# Altium schematic sheet CAN.SchDoc
size A3
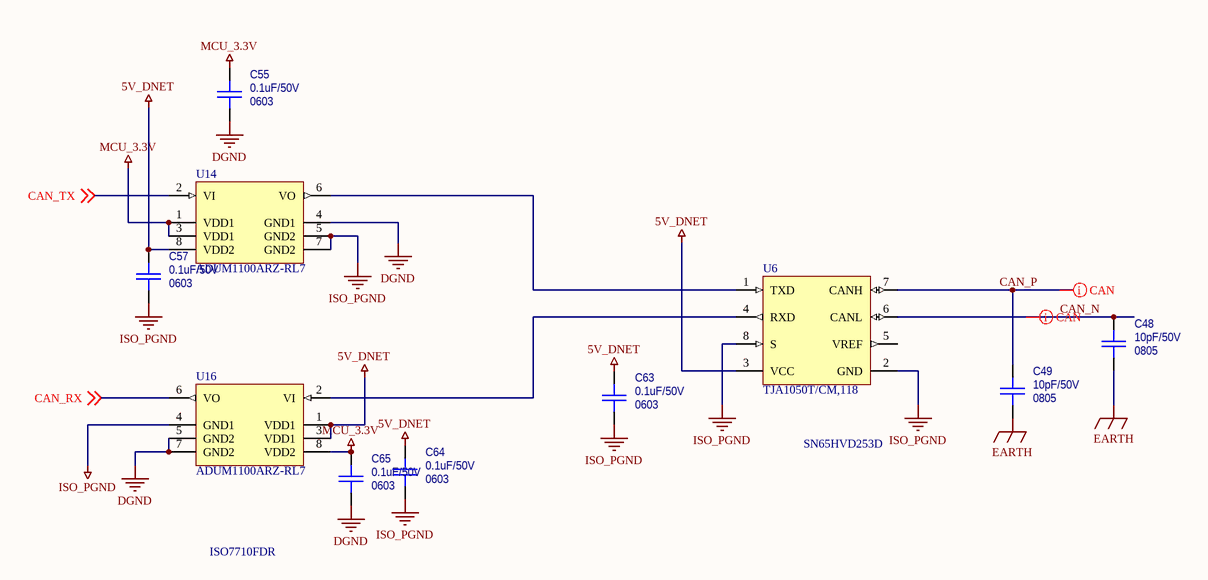
[diagram p0: CAN.SchDoc]

## Parts
C48  Package: 0805  [CAPC2012X127N_0805]  (hidden comment: 10pF/50V)  (no BOM)
C49  Package: 0805  [CAPC2012X127N_0805]  (hidden comment: 10pF/50V)  (no BOM)
C55  Package: 0603  [CAPC1608X092N_0603]  (hidden comment: 0.1uF/50V)  (no BOM)
C57  Package: 0603  [CAPC1608X092N_0603]  (hidden comment: 0.1uF/50V)  (no BOM)
C63  Package: 0603  [CAPC1608X092N_0603]  (hidden comment: 0.1uF/50V)  (no BOM)
C64  Package: 0603  [CAPC1608X092N_0603]  (hidden comment: 0.1uF/50V)  (no BOM)
C65  Package: 0603  [CAPC1608X092N_0603]  (hidden comment: 0.1uF/50V)  (no BOM)
U6  TJA1050T/CM,118  [NXP-SOT96-1_N]  (no BOM)
U14  ADUM1100ARZ-RL7  [ADI-R-8_N]  (no BOM)
U16  ADUM1100ARZ-RL7  [ADI-R-8_N]  (no BOM)

## Nets
5V_DNET: C57.1 C63.1 C64.1 U6.3(VCC) U14.8(VDD2) U16.1(VDD1) U16.3(VDD1)
DGND: C55.2 C65.2 U14.4(GND1) U16.5(GND2) U16.7(GND2)
EARTH: C48.2 C49.2
ISO_PGND: C57.2 C63.2 C64.2 U6.2(GND) U6.8(S) U14.5(GND2) U14.7(GND2) U16.4(GND1)
MCU_3.3V: C55.1 C65.1 U14.1(VDD1) U14.3(VDD1) U16.8(VDD2)
CAN_N: C48.1 U6.6(CANL)
CAN_P: C49.1 U6.7(CANH)
CAN_RX: U16.6(VO) ; off-sheet CAN_RX
CAN_TX: U14.2(VI) ; off-sheet CAN_TX
NetU6_1: U6.1(TXD) U14.6(VO)
NetU6_4: U6.4(RXD) U16.2(VI)

Not connected (* = marked no-connect by the designer): U6 5(VREF)

## Layout directives
differential pair: CAN_N, CAN_P

## Notes on the sheet
- SN65HVD253D
- ISO7710FDR

## Library data of the parts
C48 C49 = Capacitor_0805: Tolerance: [tol]; TempCo: [tempco]; Voltage Rating: [voltage]; Power Rating: *; Value: 10pF/50V; SupplierDescription: CAP CER 10PF 500V C0G/NP0 0805
C55 C57 C63-C65 = Capacitor_0603: PartNumber: CC0603KRX7R9BB104; Tolerance: [tol]; TempCo: [tempco]; Voltage Rating: [voltage]; Supplier 1: *; Supplier Part Number 1: *; Value: 0.1uF/50V; SupplierDescription: CAP CER 0.1UF 50V X7R 0603
U6 = TJA1050T/CM,118: Number of Drivers/Receivers: 1/1; Product Training Modules: CANandLINBusTransceiver; Protocol: CAN; Receiver Hysteresis: 70mV; Minimum Quantity: Transceiver; Voltage - Supply: 4.75V~5.25V; Other Names: 568-10292-1; PCN Packaging: LighterPackingReels30/Mar/2014; PCN Obsolescence: TJA105028/Apr/2013 / MultipleDevices19/Apr/2013; Standard Package: 1; Package Reference: SOT96-1; Mounting Type: SurfaceMount; Package / Case: 8-SOIC(0.154",3.90mmWidth); Package Description: 8-Pin Small Outline Integrated Circuit, Body 4.9 x 3.9 mm, Pitch 1.27 mm; Package/Case: 8-SOIC(0.154",3.90mmWidth); Supplier Device Package: 8-SO; Quantity Available: CutTape(CT)AlternatePackaging; Type: Transceiver; Packaging: CutTape(CT); Value: TJA1050T/CM,118
U14 U16 = ADUM1100ARZ-RL7: Mounting Technology: Surface Mount; PartNumber: ADUM1100ARZ-RL7; PackageDescription: 8-Pin Standard Small Outline Package, Body 4.9 x 3.9 mm, Pitch 1.27 mm; PackageVersion: 060506-A, 06/2006; PackageReference: R-8; Value: ADUM1100ARZ-RL7